# Altium schematic sheet NBP1 Xilinx Spartan-IIE PQ208 Rev1.02.SchDoc: Spartan 2E 300 Daughterboard
size C; Organization: Altium Limited; Address1: L3, 12a Rodborough Rd; Address2: Frenchs Forest; Address3: NSW; Address4: Australia 2086; DocumentNumber: 1; Revision: 1.02; SheetNumber: 1; SheetTotal: 1
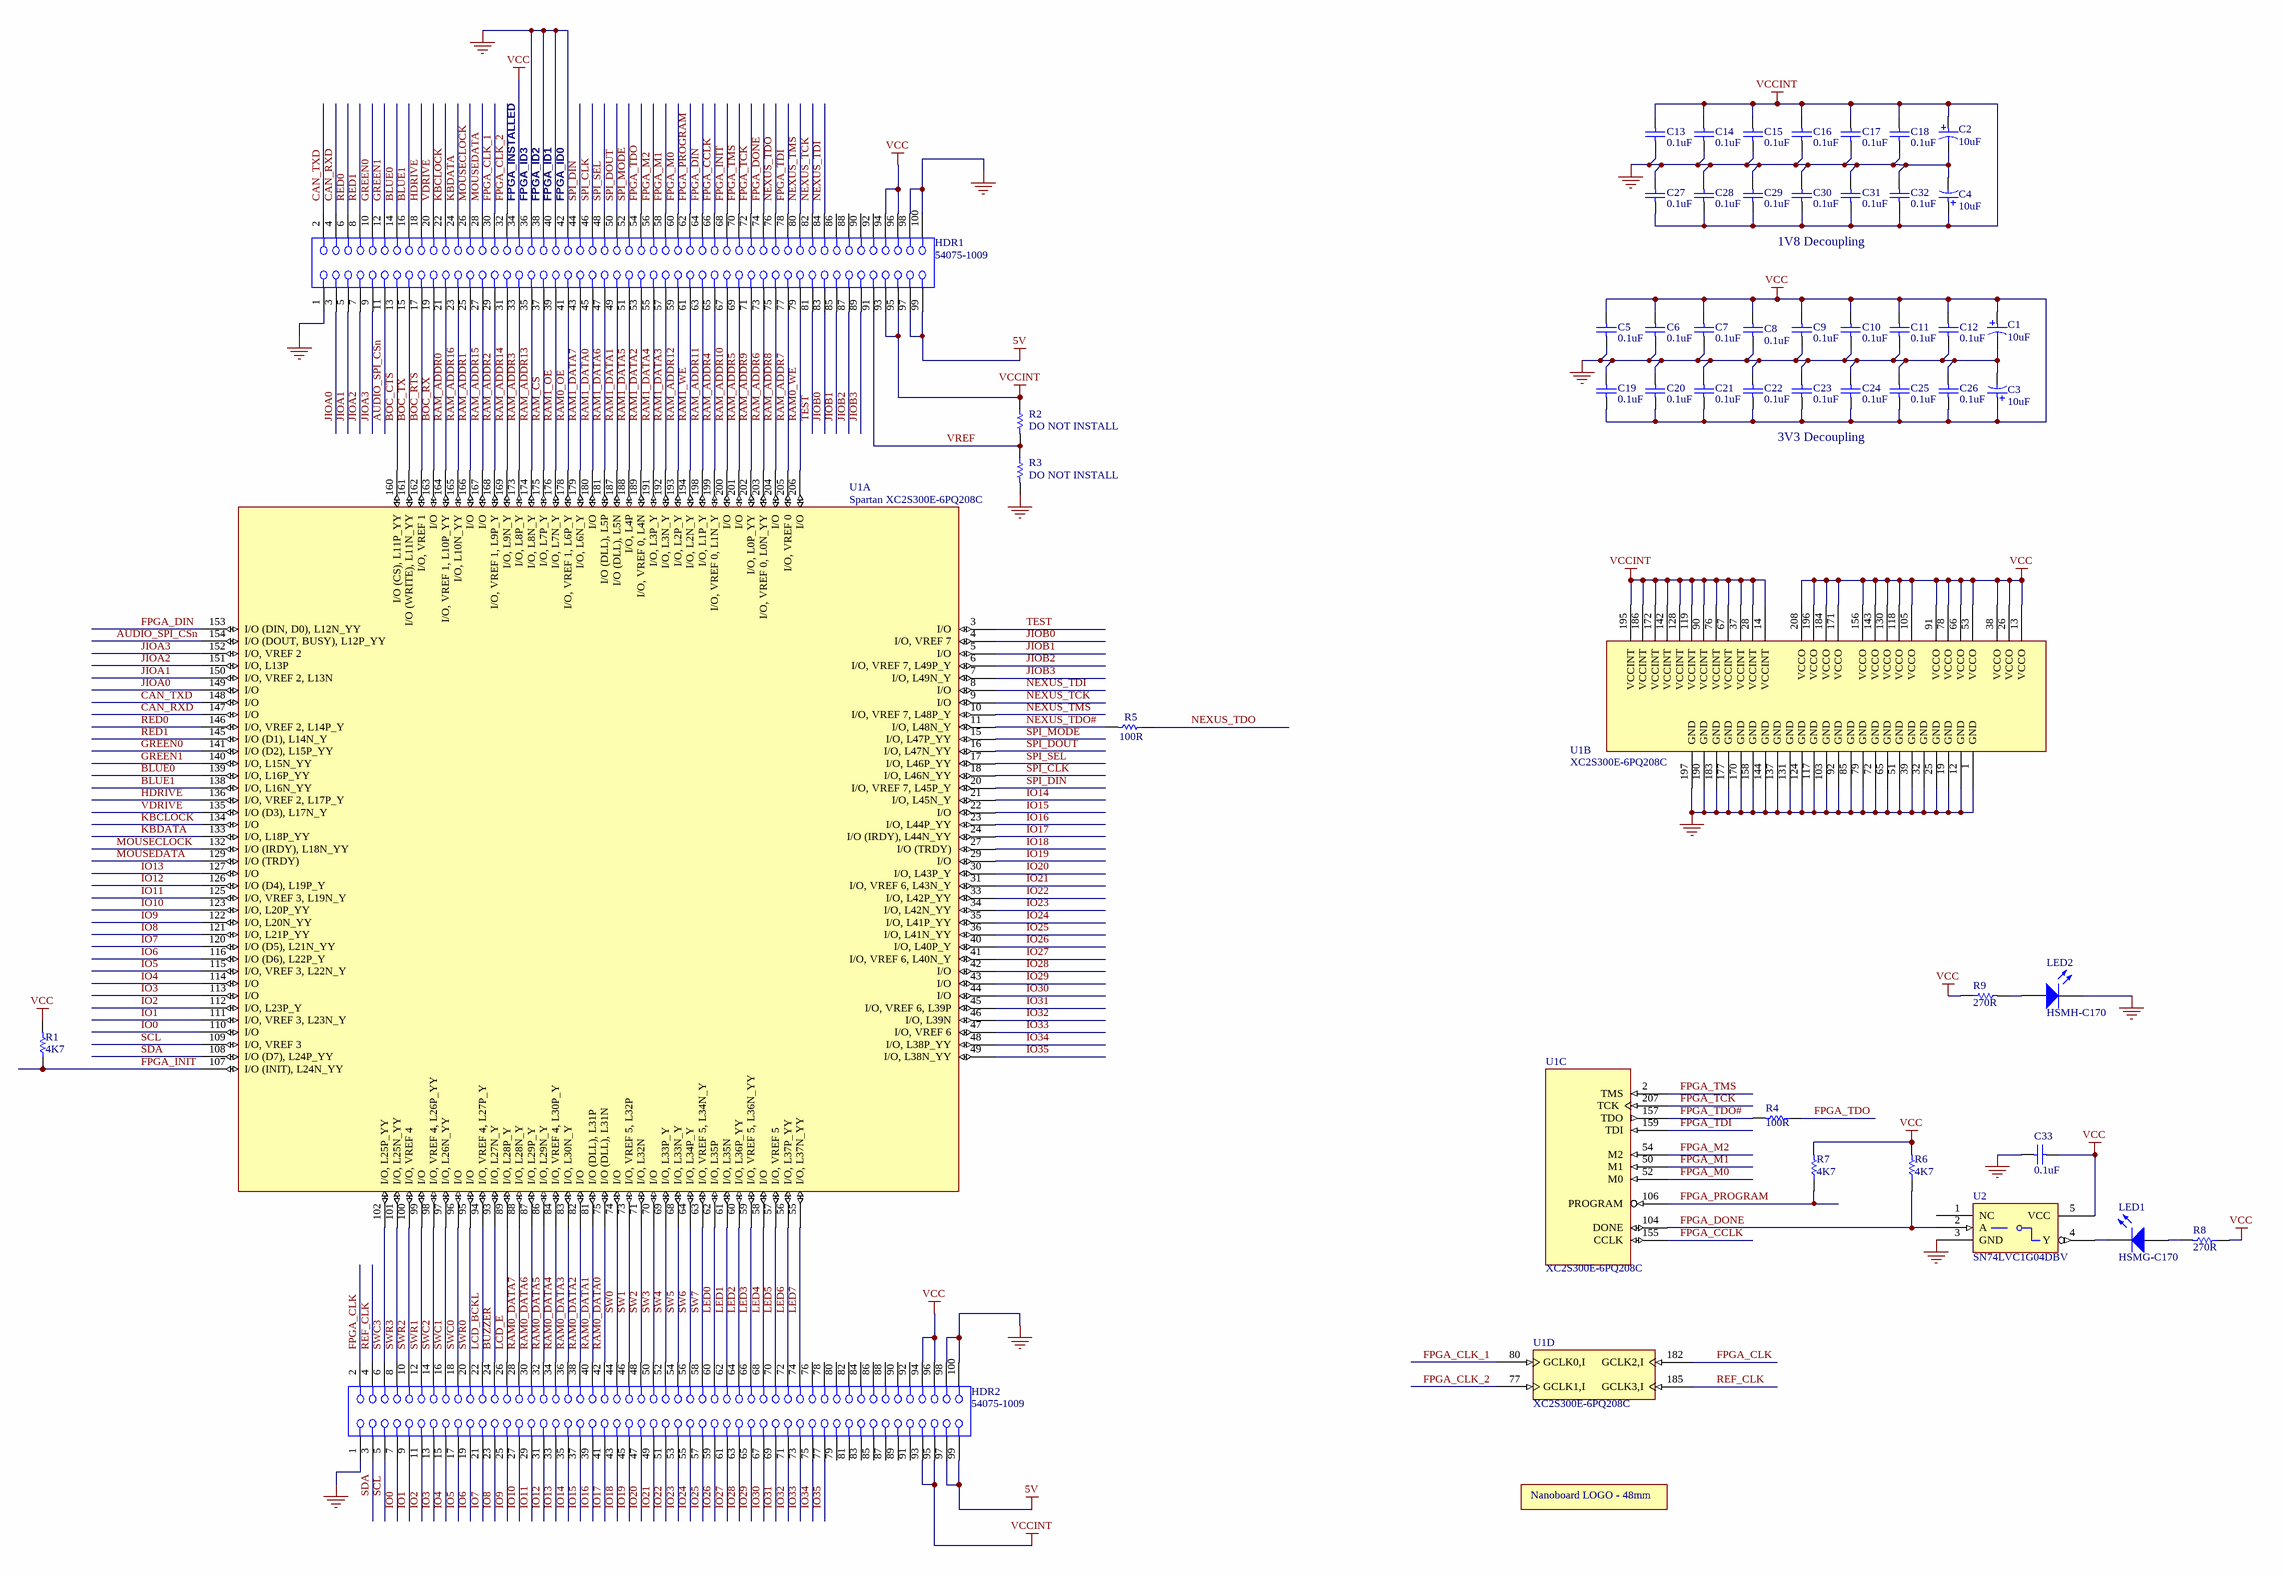
[diagram p0: NBP1 Xilinx Spartan-IIE PQ208 Rev1.02.SchDoc]

## Parts
?  NanoboardLogo48mm  [NanoBoard1_LOGO]  (value not drawn)  (graphical)
C1  10uF  [MCCT-B]
C2  10uF  [MCCT-B]
C3  10uF  [MCCT-B]
C4  10uF  [MCCT-B]
C5  0.1uF  [CC2012-0805]
C6  0.1uF  [CC2012-0805]
C7  0.1uF  [CC2012-0805]
C8  0.1uF  [CC2012-0805]
C9  0.1uF  [CC2012-0805]
C10  0.1uF  [CC2012-0805]
C11  0.1uF  [CC2012-0805]
C12  0.1uF  [CC2012-0805]
C13  0.1uF  [CC2012-0805]
C14  0.1uF  [CC2012-0805]
C15  0.1uF  [CC2012-0805]
C16  0.1uF  [CC2012-0805]
C17  0.1uF  [CC2012-0805]
C18  0.1uF  [CC2012-0805]
C19  0.1uF  [CC2012-0805]
C20  0.1uF  [CC2012-0805]
C21  0.1uF  [CC2012-0805]
C22  0.1uF  [CC2012-0805]
C23  0.1uF  [CC2012-0805]
C24  0.1uF  [CC2012-0805]
C25  0.1uF  [CC2012-0805]
C26  0.1uF  [CC2012-0805]
C27  0.1uF  [CC2012-0805]
C28  0.1uF  [CC2012-0805]
C29  0.1uF  [CC2012-0805]
C30  0.1uF  [CC2012-0805]
C31  0.1uF  [CC2012-0805]
C32  0.1uF  [CC2012-0805]
C33  0.1uF  [CC2012-0805]
HDR1  54075-1009  [54075]
HDR2  54075-1009  [54075]
LED1  HSMG-C170  [SMD _LED]
LED2  HSMH-C170  [SMD _LED]
R1  4K7  [CC2012-0805]
R2  DO NOT INSTALL  [CC2012-0805]
R3  DO NOT INSTALL  [CC2012-0805]
R4  100R  [CC2012-0805]
R5  100R  [CC2012-0805]
R6  4K7  [CC2012-0805]
R7  4K7  [CC2012-0805]
R8  270R  [CC2012-0805]
R9  270R  [CC2012-0805]
U1  Spartan XC2S300E-6PQ208C  [F-QFP28x28-G208/P.5N]  (parts A,B,C,D of 4)
U2  SN74LVC1G04DBV  [SO-G5/P.95]

## Nets
5V: HDR1.97 HDR1.99 HDR2.97 HDR2.99
GND: C1.2 C2.2 C3.2 C4.2 C5.1 C6.1 C7.1 C8.1 C9.1 C10.1 C11.1 C12.1 C13.1 C14.1 C15.1 C16.1 C17.1 C18.1 C19.2 C20.2 C21.2 C22.2 C23.2 C24.2 C25.2 C26.2 C27.2 C28.2 C29.2 C30.2 C31.2 C32.2 C33.2 HDR1.1 HDR1.36 HDR1.38 HDR1.40 HDR1.42 HDR1.98 HDR1.100 HDR2.1 HDR2.98 HDR2.100 LED2.2(K) R3.2 U1.1(GND) U1.12(GND) U1.19(GND) U1.25(GND) U1.32(GND) U1.39(GND) U1.51(GND) U1.65(GND) U1.72(GND) U1.79(GND) U1.85(GND) U1.92(GND) U1.103(GND) U1.117(GND) U1.124(GND) U1.131(GND) U1.137(GND) U1.144(GND) U1.158(GND) U1.170(GND) U1.177(GND) U1.183(GND) U1.190(GND) U1.197(GND) U2.3(GND)
VCC: C1.1 C3.1 C5.2 C6.2 C7.2 C8.2 C9.2 C10.2 C11.2 C12.2 C19.1 C20.1 C21.1 C22.1 C23.1 C24.1 C25.1 C26.1 C33.1 HDR1.34 HDR1.94 HDR1.96 HDR2.94 HDR2.96 R1.2 R6.2 R7.2 R8.1 R9.1 U1.13(VCCO) U1.26(VCCO) U1.38(VCCO) U1.53(VCCO) U1.66(VCCO) U1.78(VCCO) U1.91(VCCO) U1.105(VCCO) U1.118(VCCO) U1.130(VCCO) U1.143(VCCO) U1.156(VCCO) U1.171(VCCO) U1.184(VCCO) U1.196(VCCO) U1.208(VCCO) U2.5(VCC)
VCCINT: C2.1 C4.1 C13.2 C14.2 C15.2 C16.2 C17.2 C18.2 C27.1 C28.1 C29.1 C30.1 C31.1 C32.1 HDR1.93 HDR1.95 HDR2.93 HDR2.95 R2.1 U1.14(VCCINT) U1.28(VCCINT) U1.37(VCCINT) U1.67(VCCINT) U1.76(VCCINT) U1.90(VCCINT) U1.119(VCCINT) U1.128(VCCINT) U1.142(VCCINT) U1.172(VCCINT) U1.186(VCCINT) U1.195(VCCINT)
AUDIO_SPI_CSn: HDR1.11 U1.154(I/O_(DOUT,_BUSY),_L12P_YY)
BLUE0: HDR1.14 U1.139(I/O,_L16P_YY)
BLUE1: HDR1.16 U1.138(I/O,_L16N_YY)
BOC_CTS: HDR1.13 U1.160(I/O_(CS),_L11P_YY)
BOC_RTS: HDR1.17 U1.162(I/O,_VREF_1)
BOC_RX: HDR1.19 U1.163(I/O)
BOC_TX: HDR1.15 U1.161(I/O_(WRITE),_L11N_YY)
BUZZER: HDR2.24 U1.93(I/O,_L27N_Y)
CAN_RXD: HDR1.4 U1.147(I/O)
CAN_TXD: HDR1.2 U1.148(I/O)
FPGA_CCLK: HDR1.66 U1.155(CCLK)
FPGA_CLK: HDR2.2 U1.182(GCLK2,I)
FPGA_CLK_1: HDR1.30 U1.80(GCLK0,I)
FPGA_CLK_2: HDR1.32 U1.77(GCLK1,I)
FPGA_DIN: HDR1.64 U1.153(I/O_(DIN,_D0),_L12N_YY)
FPGA_DONE: HDR1.74 R6.1 U1.104(DONE) U2.2(A)
FPGA_INIT: HDR1.68 R1.1 U1.107(I/O_(INIT),_L24N_YY)
FPGA_M0: HDR1.60 U1.52(M0)
FPGA_M1: HDR1.58 U1.50(M1)
FPGA_M2: HDR1.56 U1.54(M2)
FPGA_PROGRAM: HDR1.62 R7.1 U1.106(PROGRAM)
FPGA_TCK: HDR1.72 U1.207(TCK)
FPGA_TDI: HDR1.78 U1.159(TDI)
FPGA_TDO: HDR1.54 R4.1
FPGA_TDO#: R4.2 U1.157(TDO)
FPGA_TMS: HDR1.70 U1.2(TMS)
GREEN0: HDR1.10 U1.141(I/O_(D2),_L15P_YY)
GREEN1: HDR1.12 U1.140(I/O,_L15N_YY)
HDRIVE: HDR1.18 U1.136(I/O,_VREF_2,_L17P_Y)
IO0: HDR2.7 U1.110(I/O)
IO1: HDR2.9 U1.111(I/O,_VREF_3,_L23N_Y)
IO2: HDR2.11 U1.112(I/O,_L23P_Y)
IO3: HDR2.13 U1.113(I/O)
IO4: HDR2.15 U1.114(I/O)
IO5: HDR2.17 U1.115(I/O,_VREF_3,_L22N_Y)
IO6: HDR2.19 U1.116(I/O_(D6),_L22P_Y)
IO7: HDR2.21 U1.120(I/O_(D5),_L21N_YY)
IO8: HDR2.23 U1.121(I/O,_L21P_YY)
IO9: HDR2.25 U1.122(I/O,_L20N_YY)
IO10: HDR2.27 U1.123(I/O,_L20P_YY)
IO11: HDR2.29 U1.125(I/O,_VREF_3,_L19N_Y)
IO12: HDR2.31 U1.126(I/O_(D4),_L19P_Y)
IO13: HDR2.33 U1.127(I/O)
IO14: HDR2.35 U1.21(I/O,_L45N_Y)
IO15: HDR2.37 U1.22(I/O)
IO16: HDR2.39 U1.23(I/O,_L44P_YY)
IO17: HDR2.41 U1.24(I/O_(IRDY),_L44N_YY)
IO18: HDR2.43 U1.27(I/O_(TRDY))
IO19: HDR2.45 U1.29(I/O)
IO20: HDR2.47 U1.30(I/O,_L43P_Y)
IO21: HDR2.49 U1.31(I/O,_VREF_6,_L43N_Y)
IO22: HDR2.51 U1.33(I/O,_L42P_YY)
IO23: HDR2.53 U1.34(I/O,_L42N_YY)
IO24: HDR2.55 U1.35(I/O,_L41P_YY)
IO25: HDR2.57 U1.36(I/O,_L41N_YY)
IO26: HDR2.59 U1.40(I/O,_L40P_Y)
IO27: HDR2.61 U1.41(I/O,_VREF_6,_L40N_Y)
IO28: HDR2.63 U1.42(I/O)
IO29: HDR2.65 U1.43(I/O)
IO30: HDR2.67 U1.44(I/O)
IO31: HDR2.69 U1.45(I/O,_VREF_6,_L39P)
IO32: HDR2.71 U1.46(I/O,_L39N)
IO33: HDR2.73 U1.47(I/O,_VREF_6)
IO34: HDR2.75 U1.48(I/O,_L38P_YY)
IO35: HDR2.77 U1.49(I/O,_L38N_YY)
JIOA0: HDR1.3 U1.149(I/O)
JIOA1: HDR1.5 U1.150(I/O,_VREF_2,_L13N)
JIOA2: HDR1.7 U1.151(I/O,_L13P)
JIOA3: HDR1.9 U1.152(I/O,_VREF_2)
JIOB0: HDR1.83 U1.4(I/O,_VREF_7)
JIOB1: HDR1.85 U1.5(I/O)
JIOB2: HDR1.87 U1.6(I/O,_VREF_7,_L49P_Y)
JIOB3: HDR1.89 U1.7(I/O,_L49N_Y)
KBCLOCK: HDR1.22 U1.134(I/O)
KBDATA: HDR1.24 U1.133(I/O,_L18P_YY)
LCD_BCKL: HDR2.22 U1.94(I/O,_VREF_4,_L27P_Y)
LCD_E: HDR2.26 U1.89(I/O,_L28P_Y)
LED0: HDR2.60 U1.62(I/O,_L35P)
LED1: HDR2.62 U1.61(I/O,_L35N)
LED2: HDR2.64 U1.60(I/O,_L36P_YY)
LED3: HDR2.66 U1.59(I/O,_VREF_5,_L36N_YY)
LED4: HDR2.68 U1.58(I/O)
LED5: HDR2.70 U1.57(I/O,_VREF_5)
LED6: HDR2.72 U1.56(I/O,_L37P_YY)
LED7: HDR2.74 U1.55(I/O,_L37N_YY)
MOUSECLOCK: HDR1.26 U1.132(I/O_(IRDY),_L18N_YY)
MOUSEDATA: HDR1.28 U1.129(I/O_(TRDY))
NEXUS_TCK: HDR1.82 U1.9(I/O)
NEXUS_TDI: HDR1.84 U1.8(I/O)
NEXUS_TDO: HDR1.76 R5.1
NEXUS_TDO#: R5.2 U1.11(I/O,_L48N_Y)
NEXUS_TMS: HDR1.80 U1.10(I/O,_VREF_7,_L48P_Y)
RAM0_DATA0: HDR2.42 U1.75(I/O_(DLL),_L31N)
RAM0_DATA1: HDR2.40 U1.81(I/O_(DLL),_L31P)
RAM0_DATA2: HDR2.38 U1.82(I/O)
RAM0_DATA3: HDR2.36 U1.83(I/O,_L30N_Y)
RAM0_DATA4: HDR2.34 U1.84(I/O,_VREF_4,_L30P_Y)
RAM0_DATA5: HDR2.32 U1.86(I/O,_L29N_Y)
RAM0_DATA6: HDR2.30 U1.87(I/O,_L29P_Y)
RAM0_DATA7: HDR2.28 U1.88(I/O,_L28N_Y)
RAM0_OE: HDR1.41 U1.178(I/O,_VREF_1,_L6P_Y)
RAM0_WE: HDR1.79 U1.206(I/O)
RAM1_DATA0: HDR1.45 U1.180(I/O)
RAM1_DATA1: HDR1.49 U1.187(I/O_(DLL),_L5N)
RAM1_DATA2: HDR1.53 U1.189(I/O,_VREF_0,_L4N)
RAM1_DATA3: HDR1.57 U1.192(I/O,_L3N_Y)
RAM1_DATA4: HDR1.55 U1.191(I/O,_L3P_Y)
RAM1_DATA5: HDR1.51 U1.188(I/O,_L4P)
RAM1_DATA6: HDR1.47 U1.181(I/O_(DLL),_L5P)
RAM1_DATA7: HDR1.43 U1.179(I/O,_L6N_Y)
RAM1_OE: HDR1.39 U1.176(I/O,_L7N_Y)
RAM1_WE: HDR1.61 U1.194(I/O,_L2N_Y)
RAM_ADDR0: HDR1.21 U1.164(I/O,_VREF_1,_L10P_YY)
RAM_ADDR1: HDR1.25 U1.166(I/O)
RAM_ADDR2: HDR1.29 U1.168(I/O,_VREF_1,_L9P_Y)
RAM_ADDR3: HDR1.33 U1.173(I/O,_L8P_Y)
RAM_ADDR4: HDR1.65 U1.199(I/O,_VREF_0,_L1N_Y)
RAM_ADDR5: HDR1.69 U1.201(I/O)
RAM_ADDR6: HDR1.73 U1.203(I/O,_VREF_0,_L0N_YY)
RAM_ADDR7: HDR1.77 U1.205(I/O,_VREF_0)
RAM_ADDR8: HDR1.75 U1.204(I/O)
RAM_ADDR9: HDR1.71 U1.202(I/O,_L0P_YY)
RAM_ADDR10: HDR1.67 U1.200(I/O)
RAM_ADDR11: HDR1.63 U1.198(I/O,_L1P_Y)
RAM_ADDR12: HDR1.59 U1.193(I/O,_L2P_Y)
RAM_ADDR13: HDR1.35 U1.174(I/O,_L8N_Y)
RAM_ADDR14: HDR1.31 U1.169(I/O,_L9N_Y)
RAM_ADDR15: HDR1.27 U1.167(I/O)
RAM_ADDR16: HDR1.23 U1.165(I/O,_L10N_YY)
RAM_CS: HDR1.37 U1.175(I/O,_L7P_Y)
RED0: HDR1.6 U1.146(I/O,_VREF_2,_L14P_Y)
RED1: HDR1.8 U1.145(I/O_(D1),_L14N_Y)
REF_CLK: HDR2.4 U1.185(GCLK3,I)
SCL: HDR2.5 U1.109(I/O,_VREF_3)
SDA: HDR2.3 U1.108(I/O_(D7),_L24P_YY)
SPI_CLK: HDR1.46 U1.18(I/O,_L46N_YY)
SPI_DIN: HDR1.44 U1.20(I/O,_VREF_7,_L45P_Y)
SPI_DOUT: HDR1.50 U1.16(I/O,_L47N_YY)
SPI_MODE: HDR1.52 U1.15(I/O,_L47P_YY)
SPI_SEL: HDR1.48 U1.17(I/O,_L46P_YY)
SW0: HDR2.44 U1.74(I/O)
SW1: HDR2.46 U1.73(I/O,_VREF_5,_L32P)
SW2: HDR2.48 U1.71(I/O,_L32N)
SW3: HDR2.50 U1.70(I/O)
SW4: HDR2.52 U1.69(I/O,_L33P_Y)
SW5: HDR2.54 U1.68(I/O,_L33N_Y)
SW6: HDR2.56 U1.64(I/O,_L34P_Y)
SW7: HDR2.58 U1.63(I/O,_VREF_5,_L34N_Y)
SWC0: HDR2.18 U1.96(I/O)
SWC1: HDR2.16 U1.97(I/O,_L26N_YY)
SWC2: HDR2.14 U1.98(I/O,_VREF_4,_L26P_YY)
SWC3: HDR2.6 U1.102(I/O,_L25P_YY)
SWR0: HDR2.20 U1.95(I/O)
SWR1: HDR2.12 U1.99(I/O)
SWR2: HDR2.10 U1.100(I/O,_VREF_4)
SWR3: HDR2.8 U1.101(I/O,_L25N_YY)
TEST: HDR1.81 U1.3(I/O)
VDRIVE: HDR1.20 U1.135(I/O_(D3),_L17N_Y)
VREF: HDR1.91 R2.2 R3.1
NetLED1_1: LED1.1(A) R8.2
NetLED1_2: LED1.2(K) U2.4(Y)
NetLED2_1: LED2.1(A) R9.2

Not connected (* = marked no-connect by the designer): HDR1 86 88 90 92; HDR2 76 78 79 80 81 82 83 84 85 86 87 88 89 90 91 92; U2 1(NC)

## Notes on the sheet
- (near HDR1) FPGA_INSTALLED
- (near HDR1) FPGA_ID3
- (near HDR1) FPGA_ID2
- (near HDR1) FPGA_ID1
- (near HDR1) FPGA_ID0
- 1V8 Decoupling
- 3V3 Decoupling
- Title
- Size:
- Date:
- File:
- C
- Number:
- Time:
- Revision:
- Sheet
- of
- (in symbol NanoboardLogo48mm) Nanoboard LOGO - 48mm

## Library data of the parts
C1-C4 = CAP_POLAR: Polar Capacitor
  C2-C4: Supplier: FARNELL; Supplier Code: 967-117
C5-C33 = CAP: Capacitor; Supplier: FARNELL; Supplier Code: 317-287
HDR1 HDR2 = 54075-1009: Board-to-Board, Docking Station, 0.80mm (.031") Pitch, Shielded Receptacle, Vertical, Ultra Low Profile, SMT; Manufacturer: Molex; Package Information: Latest Revision: Jun-2001; Mating Height: 8.5mm; Voltage: 100V; Current: 0.5A; Contact Resistance: 40mOhm max; PCB Layout: Complies with Manufacturer's Recommendation.; Published: 15-Oct-2003; Datasheet: Latest Revision: Feb-2002; Package Reference: 54075; Publisher: Altium Limited
LED1 LED2 = HSMX-C670: Typical RED GaAs SMD LED Agilent make; Manufacturer: Generic Components; Class I: Optoelectronic; Fitted: True; Published: 8-Jun-2000; Revision: July-2002: Re-released for DXP Platform.; Publisher: Altium Limited; Class II: LED
R1-R9 = RES: Resistor
U1 = XC2S300E-6PQ208I: 1.8V Field-Programmable Gate Array; Manufacturer: Xilinx; Package Information: Latest Revision: 1-Jun-2000; Class I: FPGA; Class II: Spartan-IIE; Published: 19-Jul-2002; Datasheet: Latest Revision: 27-Jun-2002; Package Reference: PQ208; Publisher: Altium Limited
U2 = SN74AHC1G04DBVR: Manufacturer: TI; Fitted: True